# Altium schematic sheet PowerModuleCell.SchDoc
size A4; SheetNumber: 2; SheetTotal: 12
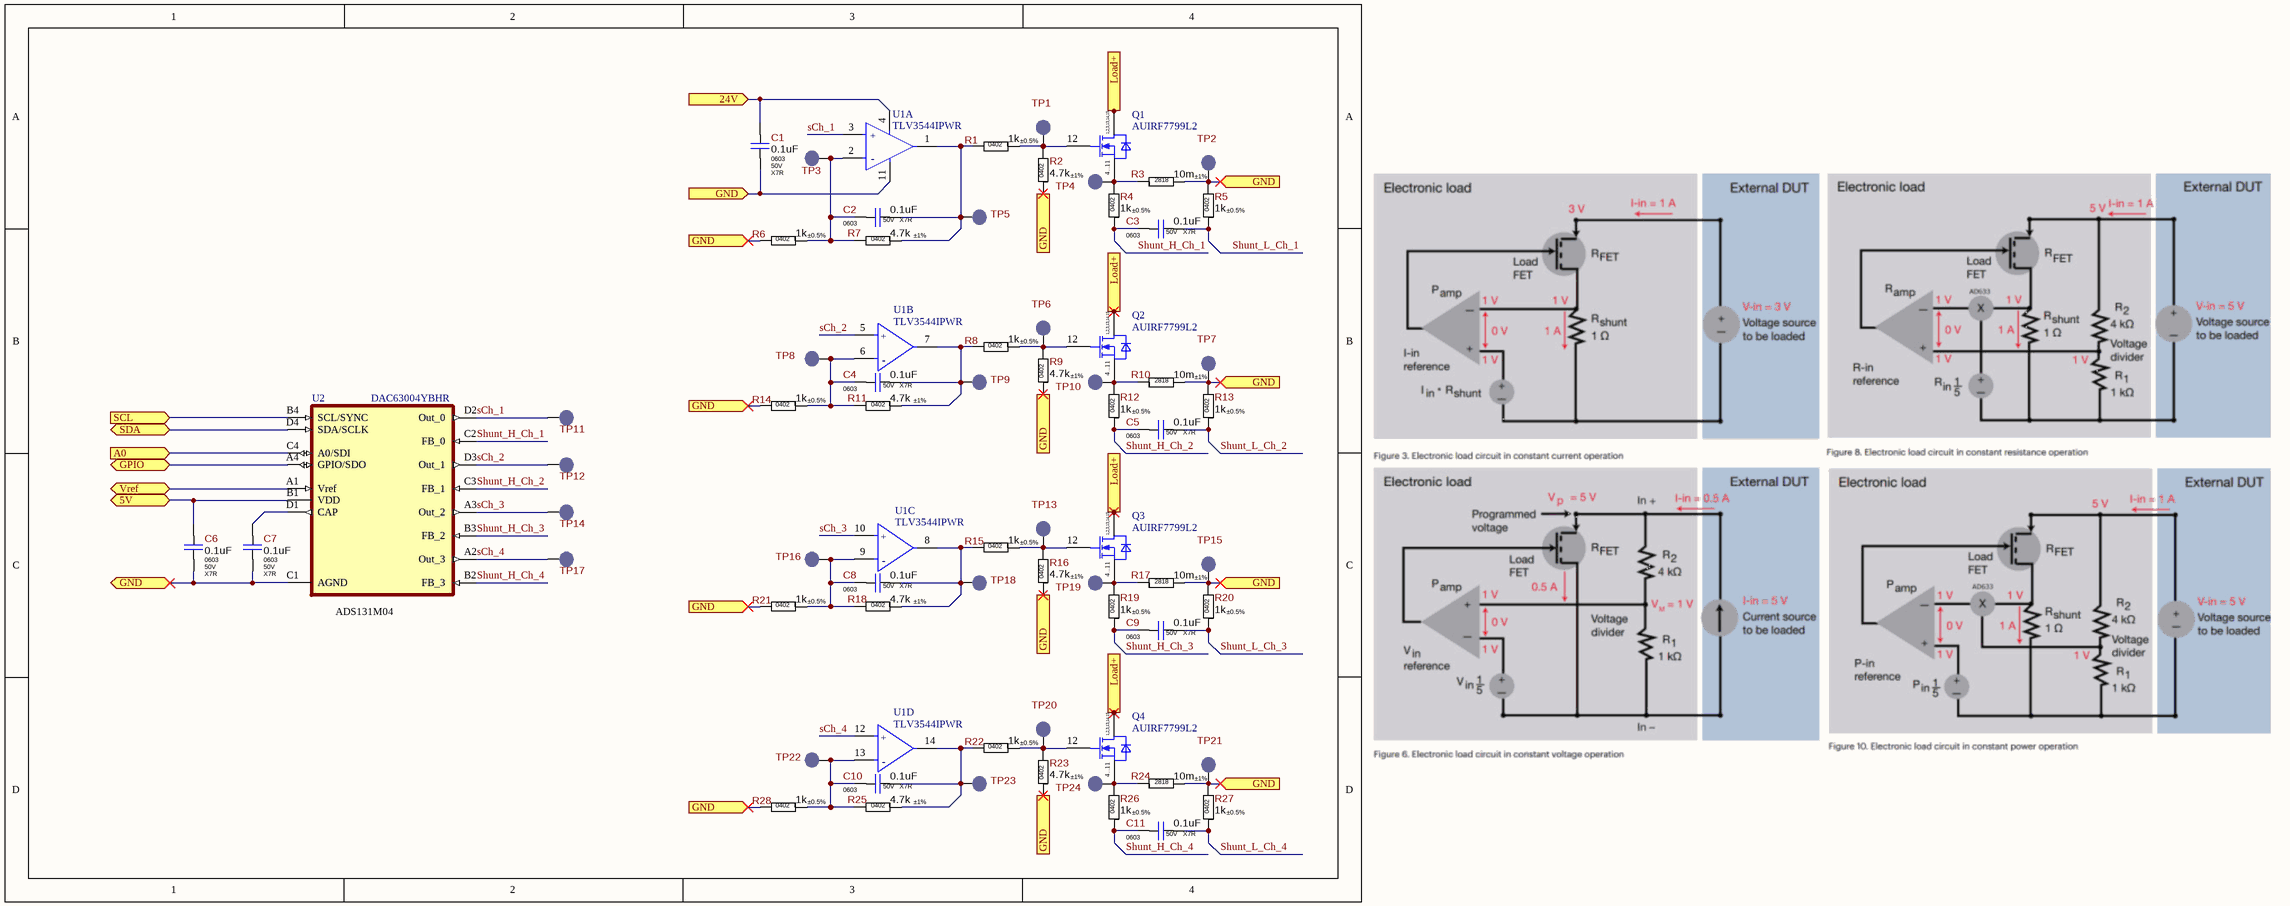
[diagram p0: PowerModuleCell.SchDoc]

## Parts
C1  Package: 0603  Voltage: 50V  Dielectric Type: X7R  [C_CERAMIC_0603_MED]  (hidden comment: 0.1uF)
C2  Package: 0603  Voltage: 50V  Dielectric Type: X7R  [C_CERAMIC_0603_MED]  (hidden comment: 0.1uF)
C3  Package: 0603  Voltage: 50V  Dielectric Type: X7R  [C_CERAMIC_0603_MED]  (hidden comment: 0.1uF)
C4  Package: 0603  Voltage: 50V  Dielectric Type: X7R  [C_CERAMIC_0603_MED]  (hidden comment: 0.1uF)
C5  Package: 0603  Voltage: 50V  Dielectric Type: X7R  [C_CERAMIC_0603_MED]  (hidden comment: 0.1uF)
C6  Package: 0603  Voltage: 50V  Dielectric Type: X7R  [C_CERAMIC_0603_MED]  (hidden comment: 0.1uF)
C7  Package: 0603  Voltage: 50V  Dielectric Type: X7R  [C_CERAMIC_0603_MED]  (hidden comment: 0.1uF)
C8  Package: 0603  Voltage: 50V  Dielectric Type: X7R  [C_CERAMIC_0603_MED]  (hidden comment: 0.1uF)
C9  Package: 0603  Voltage: 50V  Dielectric Type: X7R  [C_CERAMIC_0603_MED]  (hidden comment: 0.1uF)
C10  Package: 0603  Voltage: 50V  Dielectric Type: X7R  [C_CERAMIC_0603_MED]  (hidden comment: 0.1uF)
C11  Package: 0603  Voltage: 50V  Dielectric Type: X7R  [C_CERAMIC_0603_MED]  (hidden comment: 0.1uF)
Q1  AUIRF7799L2  [DIRECTFET-L8-V]
Q2  AUIRF7799L2  [DIRECTFET-L8-V]
Q3  AUIRF7799L2  [DIRECTFET-L8-V]
Q4  AUIRF7799L2  [DIRECTFET-L8-V]
R1  Tolerance: ±0.5%  Package: 0402  [R_ANY_CHIP_0402_HI]  (hidden comment: 1k)
R2  Tolerance: ±1%  Package: 0402  [R_ANY_CHIP_0402_HI]  (hidden comment: 4.7k)
R3  Tolerance: ±1%  Package: 2818  [WSHP2818]  (hidden comment: 10m)
R4  Tolerance: ±0.5%  Package: 0402  [R_ANY_CHIP_0402_HI]  (hidden comment: 1k)
R5  Tolerance: ±0.5%  Package: 0402  [R_ANY_CHIP_0402_HI]  (hidden comment: 1k)
R6  Tolerance: ±0.5%  Package: 0402  [R_ANY_CHIP_0402_HI]  (hidden comment: 1k)
R7  Tolerance: ±1%  Package: 0402  [R_ANY_CHIP_0402_HI]  (hidden comment: 4.7k)
R8  Tolerance: ±0.5%  Package: 0402  [R_ANY_CHIP_0402_HI]  (hidden comment: 1k)
R9  Tolerance: ±1%  Package: 0402  [R_ANY_CHIP_0402_HI]  (hidden comment: 4.7k)
R10  Tolerance: ±1%  Package: 2818  [WSHP2818]  (hidden comment: 10m)
R11  Tolerance: ±1%  Package: 0402  [R_ANY_CHIP_0402_HI]  (hidden comment: 4.7k)
R12  Tolerance: ±0.5%  Package: 0402  [R_ANY_CHIP_0402_HI]  (hidden comment: 1k)
R13  Tolerance: ±0.5%  Package: 0402  [R_ANY_CHIP_0402_HI]  (hidden comment: 1k)
R14  Tolerance: ±0.5%  Package: 0402  [R_ANY_CHIP_0402_HI]  (hidden comment: 1k)
R15  Tolerance: ±0.5%  Package: 0402  [R_ANY_CHIP_0402_HI]  (hidden comment: 1k)
R16  Tolerance: ±1%  Package: 0402  [R_ANY_CHIP_0402_HI]  (hidden comment: 4.7k)
R17  Tolerance: ±1%  Package: 2818  [WSHP2818]  (hidden comment: 10m)
R18  Tolerance: ±1%  Package: 0402  [R_ANY_CHIP_0402_HI]  (hidden comment: 4.7k)
R19  Tolerance: ±0.5%  Package: 0402  [R_ANY_CHIP_0402_HI]  (hidden comment: 1k)
R20  Tolerance: ±0.5%  Package: 0402  [R_ANY_CHIP_0402_HI]  (hidden comment: 1k)
R21  Tolerance: ±0.5%  Package: 0402  [R_ANY_CHIP_0402_HI]  (hidden comment: 1k)
R22  Tolerance: ±0.5%  Package: 0402  [R_ANY_CHIP_0402_HI]  (hidden comment: 1k)
R23  Tolerance: ±1%  Package: 0402  [R_ANY_CHIP_0402_HI]  (hidden comment: 4.7k)
R24  Tolerance: ±1%  Package: 2818  [WSHP2818]  (hidden comment: 10m)
R25  Tolerance: ±1%  Package: 0402  [R_ANY_CHIP_0402_HI]  (hidden comment: 4.7k)
R26  Tolerance: ±0.5%  Package: 0402  [R_ANY_CHIP_0402_HI]  (hidden comment: 1k)
R27  Tolerance: ±0.5%  Package: 0402  [R_ANY_CHIP_0402_HI]  (hidden comment: 1k)
R28  Tolerance: ±0.5%  Package: 0402  [R_ANY_CHIP_0402_HI]  (hidden comment: 1k)
TP1  LED_LINK  [TP_SMD_2mm]  (value not drawn)  (no BOM)
TP2  LED_LINK  [TP_SMD_2mm]  (value not drawn)  (no BOM)
TP3  LED_LINK  [TP_SMD_2mm]  (value not drawn)  (no BOM)
TP4  LED_LINK  [TP_SMD_2mm]  (value not drawn)  (no BOM)
TP5  LED_LINK  [TP_SMD_2mm]  (value not drawn)  (no BOM)
TP6  LED_LINK  [TP_SMD_2mm]  (value not drawn)  (no BOM)
TP7  LED_LINK  [TP_SMD_2mm]  (value not drawn)  (no BOM)
TP8  LED_LINK  [TP_SMD_2mm]  (value not drawn)  (no BOM)
TP9  LED_LINK  [TP_SMD_2mm]  (value not drawn)  (no BOM)
TP10  LED_LINK  [TP_SMD_2mm]  (value not drawn)  (no BOM)
TP11  LED_LINK  [TP_SMD_2mm]  (value not drawn)  (no BOM)
TP12  LED_LINK  [TP_SMD_2mm]  (value not drawn)  (no BOM)
TP13  LED_LINK  [TP_SMD_2mm]  (value not drawn)  (no BOM)
TP14  LED_LINK  [TP_SMD_2mm]  (value not drawn)  (no BOM)
TP15  LED_LINK  [TP_SMD_2mm]  (value not drawn)  (no BOM)
TP16  LED_LINK  [TP_SMD_2mm]  (value not drawn)  (no BOM)
TP17  LED_LINK  [TP_SMD_2mm]  (value not drawn)  (no BOM)
TP18  LED_LINK  [TP_SMD_2mm]  (value not drawn)  (no BOM)
TP19  LED_LINK  [TP_SMD_2mm]  (value not drawn)  (no BOM)
TP20  LED_LINK  [TP_SMD_2mm]  (value not drawn)  (no BOM)
TP21  LED_LINK  [TP_SMD_2mm]  (value not drawn)  (no BOM)
TP22  LED_LINK  [TP_SMD_2mm]  (value not drawn)  (no BOM)
TP23  LED_LINK  [TP_SMD_2mm]  (value not drawn)  (no BOM)
TP24  LED_LINK  [TP_SMD_2mm]  (value not drawn)  (no BOM)
U1  TLV3544IPWR  [TSSOP-14]  (parts A,B,C,D of 4)
U2  DAC63004YBHR  [BGA16C50P4X4_200X200X60]

## Ports
5V (bidir, see PowerLoadAdjustableModule[5C], DC-DC_5V0_To_24V_TPS61175PWPR[1B], Ref_2V5_LM4132AMF[2B]), 24V (in, see PowerLoadAdjustableModule[5D], DC-DC_5V0_To_24V_TPS61175PWPR[3B]), A0 (in, see PowerLoadAdjustableModule[4C]), GND (bidir, see PowerLoadAdjustableModule[5C], DC-DC_5V0_To_24V_TPS61175PWPR[1C], DC-DC_5V0_To_24V_TPS61175PWPR[3C], Opto_AQY280SX[2C], Ref_2V5_LM4132AMF[2B]), GND (in, see PowerLoadAdjustableModule[5C], DC-DC_5V0_To_24V_TPS61175PWPR[1C], DC-DC_5V0_To_24V_TPS61175PWPR[3C], Opto_AQY280SX[2C], Ref_2V5_LM4132AMF[2B]), GPIO (bidir, see PowerLoadAdjustableModule[4D]), Load+ (in, see PowerLoadAdjustableModule[4D]), SCL (in, see PowerLoadAdjustableModule[4C]), SDA (bidir, see PowerLoadAdjustableModule[4C]), Vref (bidir, see PowerLoadAdjustableModule[4D], Ref_2V5_LM4132AMF[3B])

## Nets
5V: C6.2 U2.B1(VDD) ; port 5V
24V: C1.2 U1.4(V+) ; port 24V
A0: U2.C4(A0/SDI) ; port A0
GND: C1.1 C6.1 C7.1 R2.2 R3.1 R5.1 R6.1 R9.2 R10.1 R13.1 R14.1 R16.2 R17.1 R20.1 R21.1 R23.2 R24.1 R27.1 R28.1 TP2.1 TP7.1 TP15.1 TP21.1 U1.11(V-) U2.C1(AGND) ; port GND
GPIO: U2.A4(GPIO/SDO) ; port GPIO
Load+: Q1.1(DRAIN1) Q1.2(DRAIN2) Q1.3(DRAIN3) Q1.13(DRAIN4) Q1.14(DRAIN5) Q1.15(DRAIN6) Q2.1(DRAIN1) Q2.2(DRAIN2) Q2.3(DRAIN3) Q2.13(DRAIN4) Q2.14(DRAIN5) Q2.15(DRAIN6) Q3.1(DRAIN1) Q3.2(DRAIN2) Q3.3(DRAIN3) Q3.13(DRAIN4) Q3.14(DRAIN5) Q3.15(DRAIN6) Q4.1(DRAIN1) Q4.2(DRAIN2) Q4.3(DRAIN3) Q4.13(DRAIN4) Q4.14(DRAIN5) Q4.15(DRAIN6) ; port Load+
sCh_1: TP11.1 U1.3(+IN_A) U2.D2(Out_0)
sCh_2: TP12.1 U1.5(+IN_B) U2.D3(Out_1)
sCh_3: TP14.1 U1.10(+IN_C) U2.A3(Out_2)
sCh_4: TP17.1 U1.12(+IN_D) U2.A2(Out_3)
SCL: U2.B4(SCL/SYNC) ; port SCL
SDA: U2.D4(SDA/SCLK) ; port SDA
Shunt_H_Ch_1: C3.1 R4.2 U2.C2(FB_0)
Shunt_H_Ch_2: C5.1 R12.2 U2.C3(FB_1)
Shunt_H_Ch_3: C9.1 R19.2 U2.B3(FB_2)
Shunt_H_Ch_4: C11.1 R26.2 U2.B2(FB_3)
Shunt_L_Ch_1: C3.2 R5.2
Shunt_L_Ch_2: C5.2 R13.2
Shunt_L_Ch_3: C9.2 R20.2
Shunt_L_Ch_4: C11.2 R27.2
Vref: U2.A1(Vref) ; port Vref
NetC2_1: C2.1 R6.2 R7.1 TP3.1 U1.2(-IN_A)
NetC2_2: C2.2 R1.1 R7.2 TP5.1 U1.1(OUT_A)
NetC4_1: C4.1 R11.1 R14.2 TP8.1 U1.6(-IN_B)
NetC4_2: C4.2 R8.1 R11.2 TP9.1 U1.7(OUT_B)
NetC7_2: C7.2 U2.D1(CAP)
NetC8_1: C8.1 R18.1 R21.2 TP16.1 U1.9(-IN_C)
NetC8_2: C8.2 R15.1 R18.2 TP18.1 U1.8(OUT_C)
NetC10_1: C10.1 R25.1 R28.2 TP22.1 U1.13(-IN_D)
NetC10_2: C10.2 R22.1 R25.2 TP23.1 U1.14(OUT_D)
NetQ1_4: Q1.4(SOURCE1) Q1.5(SOURCE2) Q1.6(SOURCE3) Q1.7(SOURCE4) Q1.8(SOURCE5) Q1.9(SOURCE6) Q1.10(SOURCE7) Q1.11(SOURCE8) R3.2 R4.1 TP4.1
NetQ1_12: Q1.12(GATE) R1.2 R2.1 TP1.1
NetQ2_4: Q2.4(SOURCE1) Q2.5(SOURCE2) Q2.6(SOURCE3) Q2.7(SOURCE4) Q2.8(SOURCE5) Q2.9(SOURCE6) Q2.10(SOURCE7) Q2.11(SOURCE8) R10.2 R12.1 TP10.1
NetQ2_12: Q2.12(GATE) R8.2 R9.1 TP6.1
NetQ3_4: Q3.4(SOURCE1) Q3.5(SOURCE2) Q3.6(SOURCE3) Q3.7(SOURCE4) Q3.8(SOURCE5) Q3.9(SOURCE6) Q3.10(SOURCE7) Q3.11(SOURCE8) R17.2 R19.1 TP19.1
NetQ3_12: Q3.12(GATE) R15.2 R16.1 TP13.1
NetQ4_4: Q4.4(SOURCE1) Q4.5(SOURCE2) Q4.6(SOURCE3) Q4.7(SOURCE4) Q4.8(SOURCE5) Q4.9(SOURCE6) Q4.10(SOURCE7) Q4.11(SOURCE8) R24.2 R26.1 TP24.1
NetQ4_12: Q4.12(GATE) R22.2 R23.1 TP20.1

## Notes on the sheet
- (near U2) ADS131M04
- (in symbol AUIRF7799L2) 1,2,3,13,14,15; 4...11
- (in symbol TLV3544IPWR, part A) +; -
- (in symbol TLV3544IPWR, part B) +; -
- (in symbol TLV3544IPWR, part C) +; -
- (in symbol TLV3544IPWR, part D) +; -

## Library data of the parts
C1-C11 = CL10B104KB8NNNC: 100nF 50V X7R ±10% 0603 Ceramic Capacitor RoHS; Manufacturer: Samsung Electro-Mechanics; Standard Lead Time: 18 Weeks; Replacement: CL10B104KB8NNND; Component Status: Released; Part Number: CL10B104KB8NNNC; Part Type: Ceramic / X7R / 0603; Component Type: SMD; Temperature Range: -55°C ~ 125°C; Tolerance: ±10%; ComponentLink1URL: https://media.digikey.com/pdf/Data%20Sheets/Samsung%20PDFs/CL_Series_MLCC_ds.pdf; Supplier 1: Digi-Key; Supplier Part Number 1: 1276-1000-2-ND; ComponentLink1Description: Datasheet; Price: 0.00273; Value: 0.1uF
Q1-Q4 = AUIRF7799L2: Insulated-Gate Field-Effect Transistor (IGFET), N-Channel / MOSFETs DirectFET 2 250V 35A 38mOhm Automotive; Part Number: AUIRF7799L2TR; Manufacturer: Infineon; Rds On: 32 mOhm; Qg: 110 nC; Vgs: - 30 V, + 30 V; Vgs th: 4 V; Pd: 125; Max T: 175 C; Turn-On Delay: 36.3 ns; Turn-Off Delay: 73.9 ns; ComponentLink1Description: Datasheet; ComponentLink1URL: https://eu.mouser.com/datasheet/2/196/auirf7799l2-1730908.pdf; Supplier 1: Mouser; Supplier Part Number 1: 942-AUIRF7799L2TR; Product Category: MOSFETs; Transistor Polarity: N-Channel; Mounting Style: SMD/SMT; Package/Case: DirectFET-L8; Vds: 250V; Id: 35A
R1 R4-R6 R8 R12-R15 R19-R22 R26-R28 = RC0402DR-071KL: 1 kOhms ±0.5% 1/16W 0402 Thick Film Resistor; Manufacturer: Yageo; Power Rating: 0.062W; Voltage: 50V; Component Status: Released; Temperature Stability: ±100ppm/°C; Replacement: NONE; Part Number: RC0402DR-071KL; Component Type: SMD; Part Type: Thick Film; Temperature Range: -55°C ~ 155°C; ComponentLink1URL: https://www.yageo.com/upload/media/product/productsearch/datasheet/rchip/PYu-RC_Group_51_RoHS_L_12.pdf; Supplier 1: Digi-Key; Supplier Part Number 1: 13-RC0402DR-071KLTR-ND; Price: 0.015; ComponentLink1Description: Datasheet; Value: 1k
R2 R7 R9 R11 R16 R18 R23 R25 = RC0402FR-074K7L: 4.7 kOhms ±1% 1/16W 0402 Thick Film Resistor; Manufacturer: Yageo; Power Rating: 0.062W; Voltage: 50V; Component Status: Released; Temperature Stability: ±100ppm/°C; Replacement: NONE; Part Number: RC0402FR-074K7L; Component Type: SMD; Part Type: Thick Film; Temperature Range: -55°C ~ 155°C; ComponentLink1URL: https://eu.mouser.com/datasheet/2/447/PYu_RC_Group_51_RoHS_L_10-1664068.pdf; Price: 0.00065; ComponentLink1Description: Datasheet; Value: 4.7k
R3 R10 R17 R24 = WSHP2818R0100FEA: Current Sense Resistors - SMD 10W .010ohms 1%; Manufacturer: Vishay; Temperature Stability: ±100ppm/°C; Replacement: NONE; Component Status: Released; Part Number: WSHP2818R0100FEA; Component Type: SMD; Power Rating: 10W; Temperature Range: -55°C ~ 155°C; ComponentLink1URL: https://www.vishay.com/doc?30347; Supplier 1: Mouser; Supplier Part Number 1: 71-WSHP2818R0100FEA; ComponentLink1Description: Datasheet; Part Type: Thick Film; Value: 10m
TP1-TP24 = Test-Point-SMD-1: Test Point SMD Pad 1.0mm/1.5mm/2mm; Part Number: TP-PAD-SMD; Replacement: NONE; Part Type: Test Point; Component Type: SMD; Temperature Range: NONE; ComponentLink1URL: NONE; ComponentLink1Description: Datasheet
U1 = TLV3544IPWR: Operational Amplifiers - Op Amps Quad 200MHz RRIO CMOS Operational Amp; Output Current per Channel: 100mA; Input Offset Voltage (Vos): 2mV; Number of Circuits: 4; Operating Supply Current: 5.2mA; Input Bias Current: 3pA; Gain Bandwidth Product: 100MHz; Slew Rate: 150V/µs; -3db Bandwidth: 200MHz; Number of Channels: 4; Max Operating Temperature: 125°C; Min Operating Temperature: -40°C; RoHS Compliant: Yes; Number of Pins: 14; Case/Package: TSSOP; Mount: Surface Mount; Packaging: Cut Tape; Part Number: TLV3544IPWR; Supplier 1: Mouser; Supplier Part Number 1: 595-TLV3544IPWR; ComponentLink1Description: Datasheet; ComponentLink1URL: https://www.ti.com/lit/gpn/tlv3544
U2 = DAC63004YBHR: Digital to Analog Converters - DAC Ultra-low-power four -channel 12-bit smar; Resolution: 12 bit; Number of Channels: 4 Channel; Settling Time: 25 us; Output Type: Current, Voltage; Interface Type: I2C, SPI; Supply Voltage - Max: 5.5 V; Supply Voltage - Min: 1.8 V; Part Number: DAC63004YBHR; Supplier 1: Mouser; Supplier Part Number 1: 595-DAC63004YBHR; ComponentLink1Description: Datasheet; ComponentLink1URL: https://www.ti.com/lit/ds/symlink/dac53004w.pdf?ts=1756086251058&ref_url=https%253A%252F%252Fwww.ti.com%252Fproduct%252FDAC53004W; Mounting Style: SMD/SMT; Package/Case: DSBGA-16; Product: Digital to Analog Converters; Product Type: DACs - Digital to Analog Converters; Subcategory: Data Converter ICs; Price, max: 4,74 €; Price, min: 2,65 €